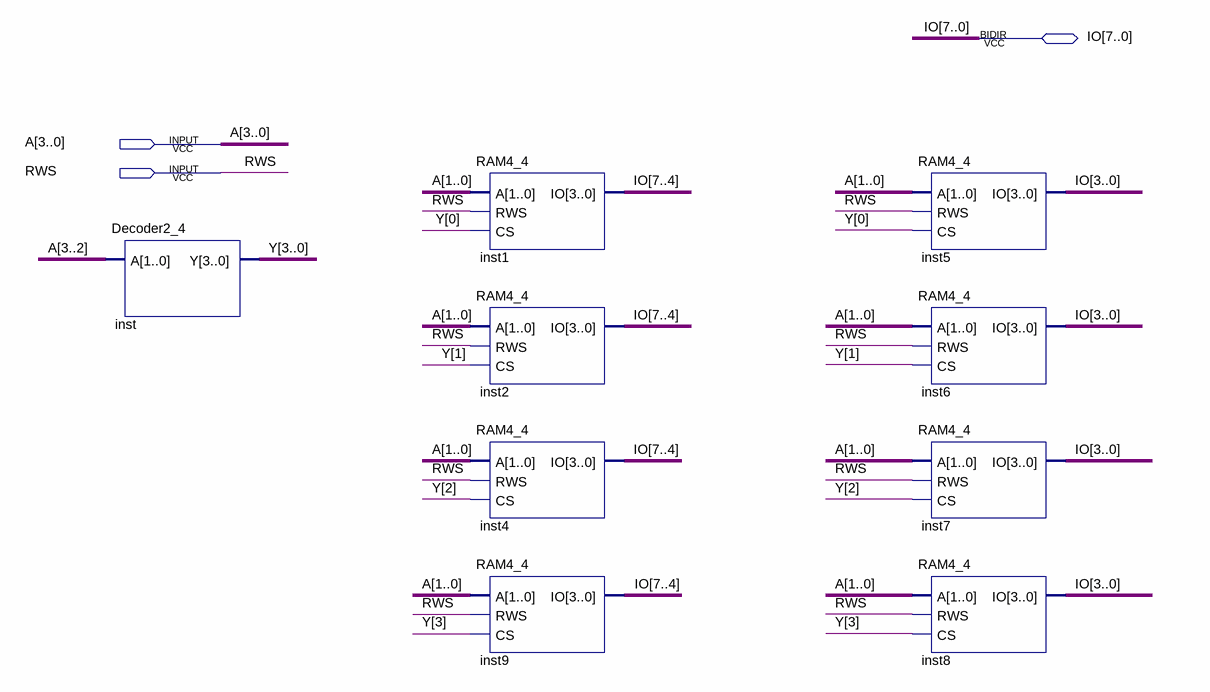
[diagram p0: schematic sheet]
// Quartus schematic RAM16_8.bdf as structural Verilog: 9 symbols, 3 pins
module RAM16_8 (
  input  [3:0] A,
  input  RWS,
  inout  [7:0] IO
);

  wire [3:0] Y;

  Decoder2_4 inst (.A(A[3:2]), .Y(Y));
  RAM4_4 inst1 (.A(A[1:0]), .RWS(RWS), .CS(Y[0]), .IO(IO[7:4]));
  RAM4_4 inst2 (.A(A[1:0]), .RWS(RWS), .CS(Y[1]), .IO(IO[7:4]));
  RAM4_4 inst4 (.A(A[1:0]), .RWS(RWS), .CS(Y[2]), .IO(IO[7:4]));
  RAM4_4 inst9 (.A(A[1:0]), .RWS(RWS), .CS(Y[3]), .IO(IO[7:4]));
  RAM4_4 inst5 (.A(A[1:0]), .RWS(RWS), .CS(Y[0]), .IO(IO[3:0]));
  RAM4_4 inst6 (.A(A[1:0]), .RWS(RWS), .CS(Y[1]), .IO(IO[3:0]));
  RAM4_4 inst7 (.A(A[1:0]), .RWS(RWS), .CS(Y[2]), .IO(IO[3:0]));
  RAM4_4 inst8 (.A(A[1:0]), .RWS(RWS), .CS(Y[3]), .IO(IO[3:0]));
endmodule
